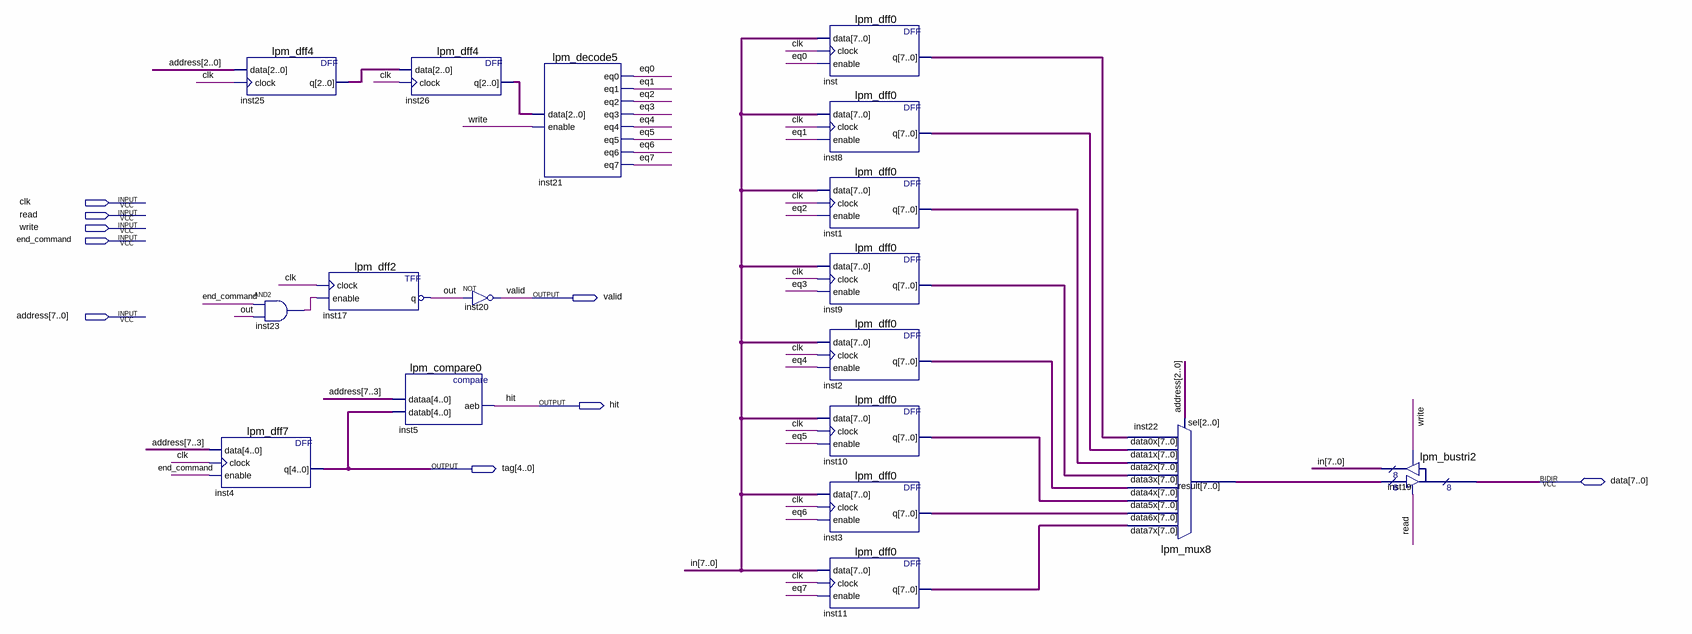
[diagram p0: schematic sheet]
// Quartus schematic String.bdf as structural Verilog: 18 symbols, 9 pins
module String (
  input  clk,
  input  read,
  input  write,
  input  end_command,
  input  [7:0] address,
  inout  [7:0] data,
  output valid,
  output hit,
  output [4:0] tag
);

  wire eq0, eq1, eq2, eq3, eq4, eq5, eq6, eq7, inst17_q, inst23_out, out;
  wire [2:0] inst25_q, inst26_q;
  wire [7:0] in, inst1_q, inst2_q, inst3_q, inst8_q, inst9_q, inst10_q, inst11_q, inst22_result, inst_q;

  lpm_dff7 inst4 (.data(address[7:3]), .clock(clk), .enable(end_command), .q(tag));
  lpm_dff4 inst25 (.data(address[2:0]), .clock(clk), .q(inst25_q));
  and inst23 (inst23_out, end_command, out);
  lpm_dff2 inst17 (.clock(clk), .enable(inst23_out), .q(inst17_q));
  not inst17_q_inverted (out, inst17_q);
  lpm_dff4 inst26 (.data(inst25_q), .clock(clk), .q(inst26_q));
  lpm_compare0 inst5 (.dataa(address[7:3]), .datab(tag), .aeb(hit));
  not inst20 (valid, out);
  lpm_decode5 inst21 (
    .data(inst26_q), .enable(write), .eq0(eq0), .eq1(eq1), .eq2(eq2), .eq3(eq3), .eq4(eq4), .eq5(eq5),
    .eq6(eq6), .eq7(eq7));
  lpm_dff0 inst (.data(in), .clock(clk), .enable(eq0), .q(inst_q));
  lpm_dff0 inst8 (.data(in), .clock(clk), .enable(eq1), .q(inst8_q));
  lpm_dff0 inst1 (.data(in), .clock(clk), .enable(eq2), .q(inst1_q));
  lpm_dff0 inst9 (.data(in), .clock(clk), .enable(eq3), .q(inst9_q));
  lpm_dff0 inst2 (.data(in), .clock(clk), .enable(eq4), .q(inst2_q));
  lpm_dff0 inst10 (.data(in), .clock(clk), .enable(eq5), .q(inst10_q));
  lpm_dff0 inst3 (.data(in), .clock(clk), .enable(eq6), .q(inst3_q));
  lpm_dff0 inst11 (.data(in), .clock(clk), .enable(eq7), .q(inst11_q));
  lpm_mux8 inst22 (
    .data7x(inst11_q), .data6x(inst3_q), .data5x(inst10_q), .data4x(inst2_q), .data3x(inst9_q),
    .data2x(inst1_q), .data1x(inst8_q), .data0x(inst_q), .sel(address[2:0]), .result(inst22_result));
  lpm_bustri2 inst19 (.enabledt(read), .data(inst22_result), .enabletr(write), .result(in), .tridata(data));
endmodule
